# Altium project Sayma_AMC.PrjPcb (part 12 of 18)

## Sheet FPGA_Banks_44_45_46_DDR64.SchDoc: Sayma AMC
size 420 x 297 mm; $$Internal___BlkDate: 0:12:25_2-9-18; $$Internal_NAME_PLACEHOLDER: a3sheet; $$Internal_Resolution: 00001mm; $$NotCommonProperty_@NAME: FPGA_XCKU040FFVA1156; $$NotCommonProperty_@PRINTORDER: 16; $$NotCommonProperty_@SHEET: FPGA Banks 44 45 46 DDR64; $$NotCommonProperty_@SHEETTOTAL: 30; CmpIndex: 988; Drawing Author: G.Kasprowicz; Drawing Number: Sayma AMC; Drawing Project: AMC FMC Carrier Board; Drawing Revision: 2.0; SymIndex: 2141; CheckedBy: P.Kulik,T.Przywozki,W.Ruclo; Author: G.Kasprowicz; CompanyName: WUT ISE; DrawnBy: G.Kasprowicz; Organization: WUT ISE; Address1: PW ISE; Address2: Nowowiejska 15/19 00-665 Warsaw; Address3: gkasprow@gmail.com; DocumentNumber: 23; Revision: 2; SheetNumber: 23; SheetTotal: 32; ModifiedBy: -; CheckedDate: -; Title2: FPGA banks 44, 45 & 46 (DDR); DivGrp: WUT ISE; Designer: G.Kasprowicz; ModifiedDate: -; ProjectName: Sensor Box
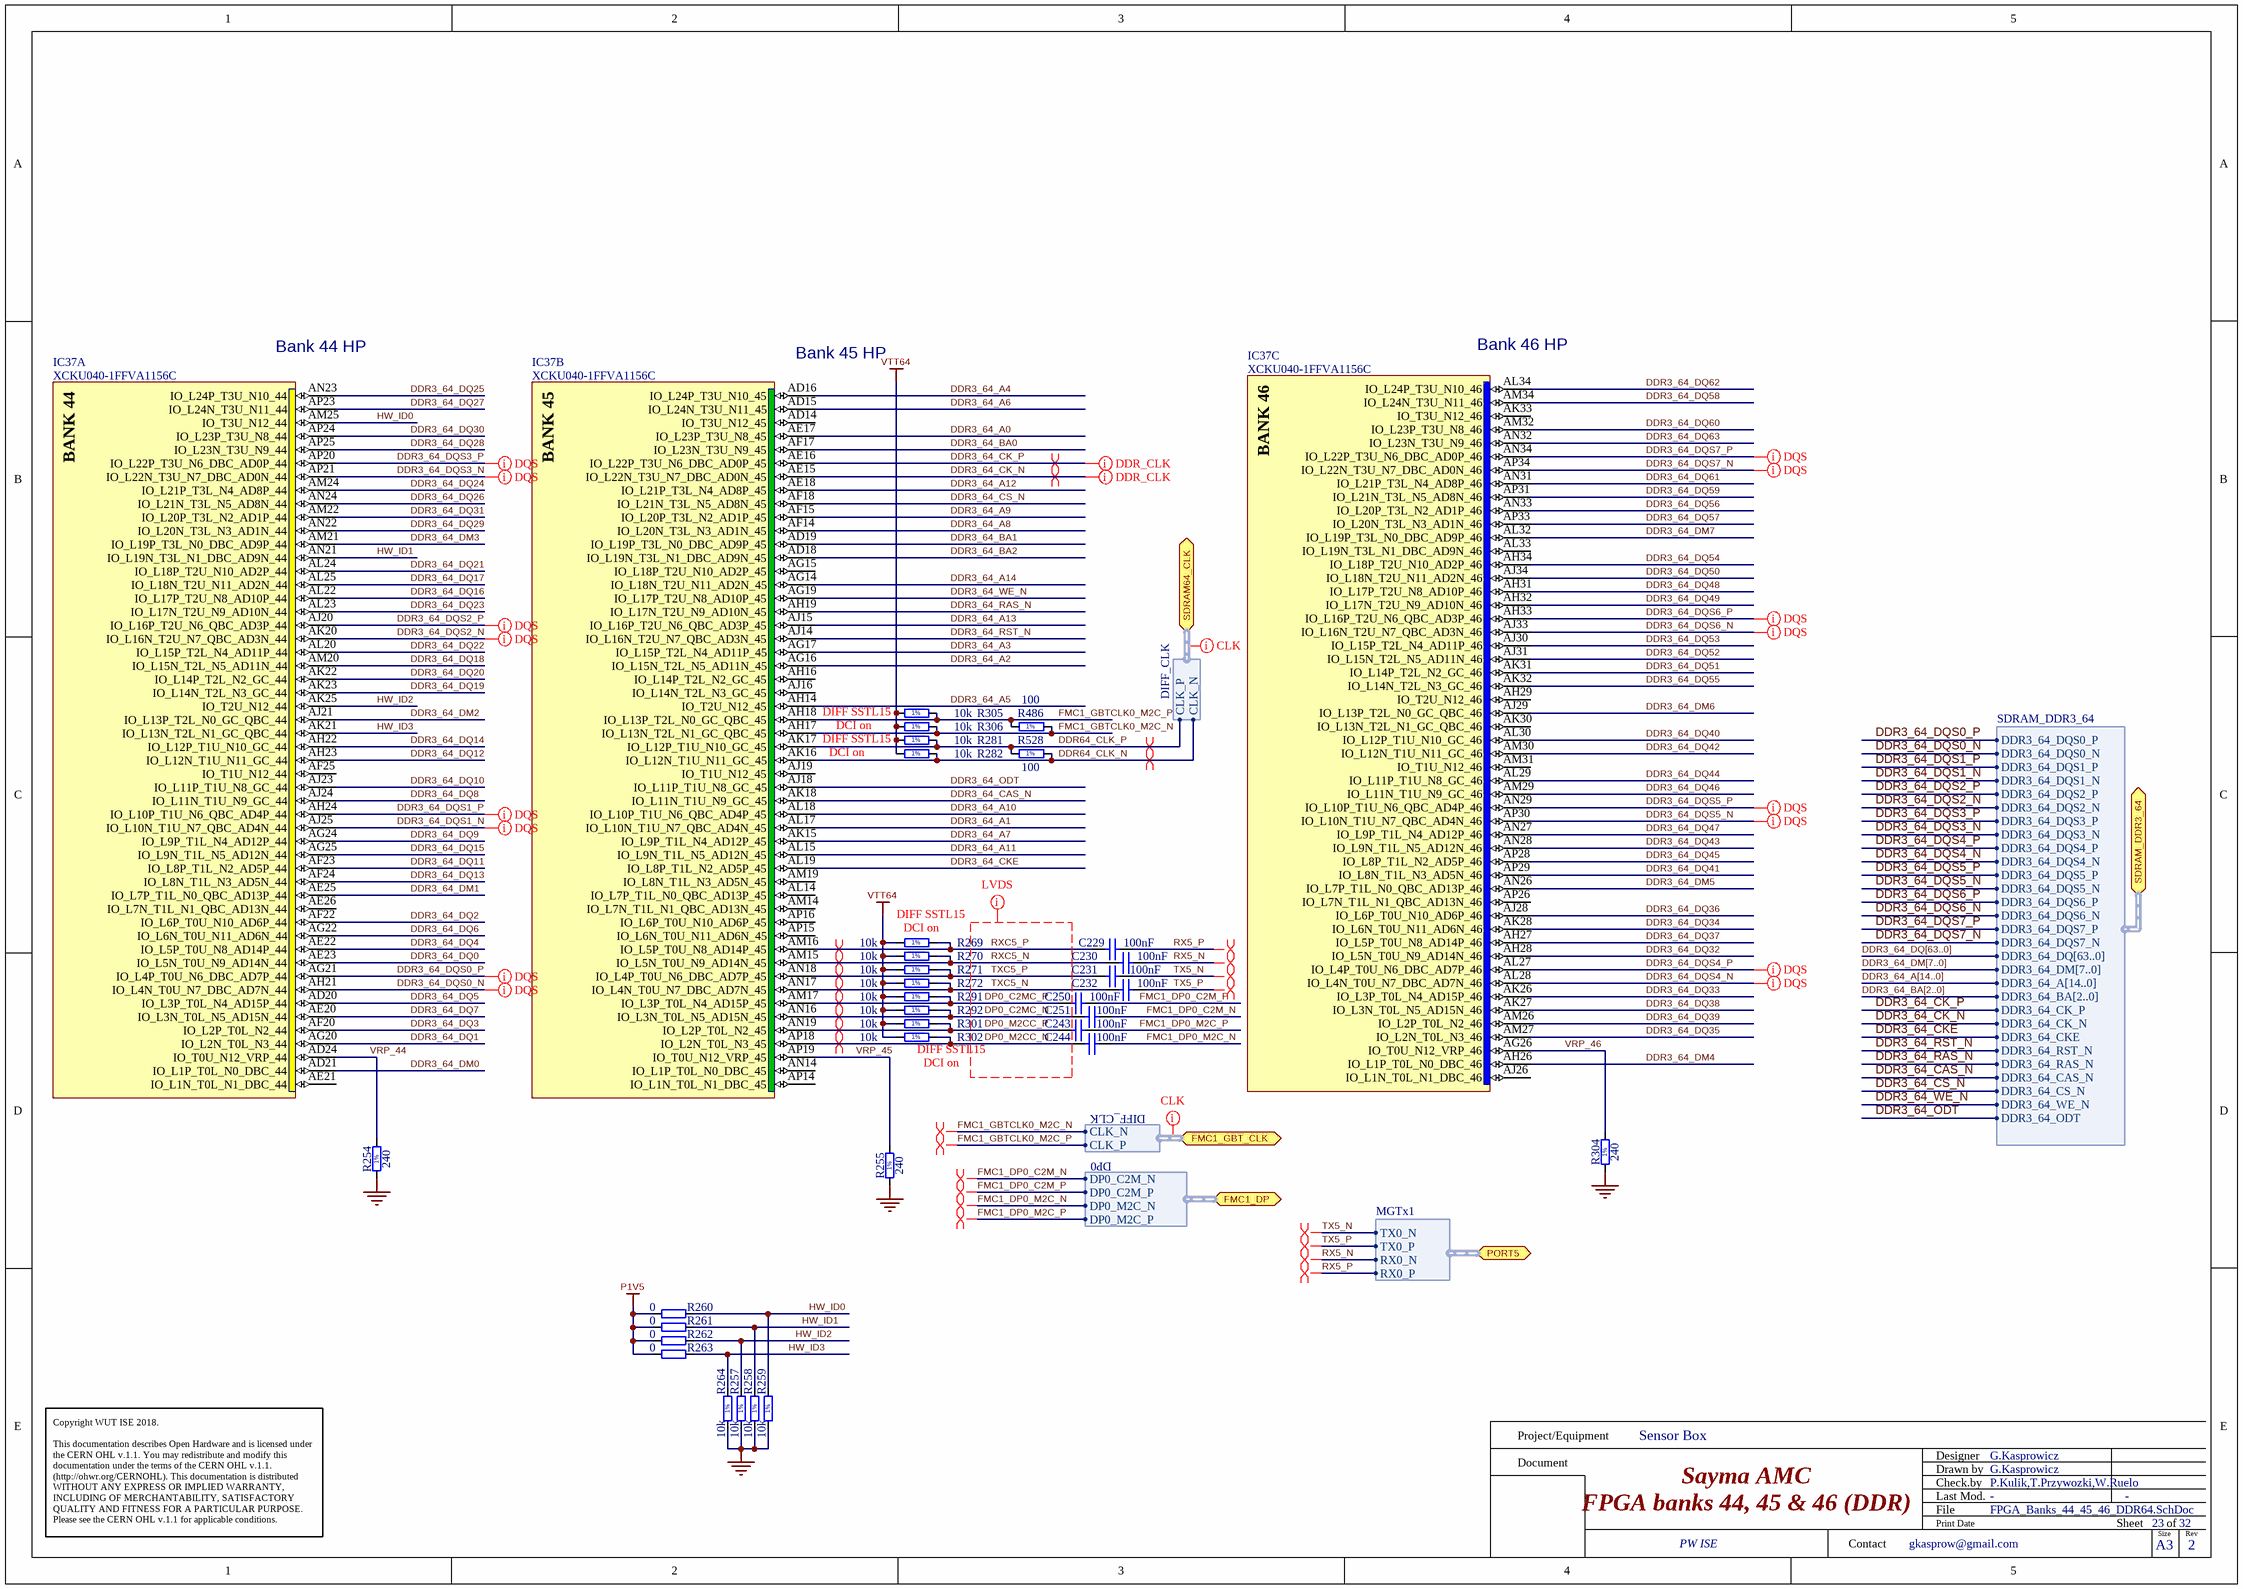
[diagram p21: FPGA_Banks_44_45_46_DDR64.SchDoc]

### Parts
C229  100nF  [CAPC0603X33N]
C230  100nF  [CAPC0603X33N]
C231  100nF  [CAPC0603X33N]
C232  100nF  [CAPC0603X33N]
C243  100nF  [CAPC0603X33N]
C244  100nF  [CAPC0603X33N]
C250  100nF  [CAPC0603X33N]
C251  100nF  [CAPC0603X33N]
IC37  XCKU040-1FFVA1156C  [BGA1156C100P34X34_3500X3500X350]  (parts A,B,C of 22)
R254  240  [RESC1005X40N]
R255  240  [RESC1005X40N]
R257  10k  [RESC1005X40N]
R258  10k  [RESC1005X40N]
R259  10k  [RESC1005X40N]
R260  0  [RESC1005X40N]
R261  0  [RESC1005X40N]
R262  0  [RESC1005X40N]
R263  0  [RESC1005X40N]
R264  10k  [RESC1005X40N]
R269  10k  [RESC1005X40N]
R270  10k  [RESC1005X40N]
R271  10k  [RESC1005X40N]
R272  10k  [RESC1005X40N]
R281  10k  [RESC1005X40N]
R282  10k  [RESC1005X40N]
R291  10k  [RESC1005X40N]
R292  10k  [RESC1005X40N]
R301  10k  [RESC1005X40N]
R302  10k  [RESC1005X40N]
R304  240  [RESC1005X40N]
R305  10k  [RESC1005X40N]
R306  10k  [RESC1005X40N]
R486  100  [RESC0603X28N]
R528  100  [RESC0603X28N]

### Ports
FMC1_DP (bidir, harness DP0), FMC1_GBT_CLK (bidir, harness DIFF_CLK), PORT5 (bidir, harness MGTx1), SDRAM64_CLK (bidir, harness DIFF_CLK), SDRAM_DDR3_64 (bidir, harness SDRAM_DDR3_64)

### Harnesses
SDRAM_DDR3_64: DDR3_64_DQS0_P, DDR3_64_DQS0_N, DDR3_64_DQS1_P, DDR3_64_DQS1_N, DDR3_64_DQS2_P, DDR3_64_DQS2_N, DDR3_64_DQS3_P, DDR3_64_DQS3_N, DDR3_64_DQS4_P, DDR3_64_DQS4_N, DDR3_64_DQS5_P, DDR3_64_DQS5_N, DDR3_64_DQS6_P, DDR3_64_DQS6_N, DDR3_64_DQS7_P, DDR3_64_DQS7_N, DDR3_64_DQ[63..0], DDR3_64_DM[7..0], DDR3_64_A[14..0], DDR3_64_BA[2..0], DDR3_64_CK_P, DDR3_64_CK_N, DDR3_64_CKE, DDR3_64_RST_N, DDR3_64_RAS_N, DDR3_64_CAS_N, DDR3_64_CS_N, DDR3_64_WE_N, DDR3_64_ODT
DIFF_CLK: CLK_P, CLK_N
DP0: DP0_C2M_N, DP0_C2M_P, DP0_M2C_N, DP0_M2C_P
MGTx1: RX0_P, RX0_N, TX0_P, TX0_N
DIFF_CLK: CLK_N, CLK_P

### Nets
GND: R254.1 R255.1 R257.1 R258.1 R259.1 R264.1 R304.1
P1V5: R260.1 R261.1 R262.1 R263.1
VTT64: R269.1 R270.1 R271.1 R272.1 R281.1 R282.1 R291.1 R292.1 R301.1 R302.1 R305.1 R306.1
DDR3_64_A0: IC37.AE17(IO_L23P_T3U_N8_45)
DDR3_64_A1: IC37.AL17(IO_L10N_T1U_N7_QBC_AD4N_45)
DDR3_64_A2: IC37.AG16(IO_L15N_T2L_N5_AD11N_45)
DDR3_64_A3: IC37.AG17(IO_L15P_T2L_N4_AD11P_45)
DDR3_64_A4: IC37.AD16(IO_L24P_T3U_N10_45)
DDR3_64_A5: IC37.AH14(IO_T2U_N12_45)
DDR3_64_A6: IC37.AD15(IO_L24N_T3U_N11_45)
DDR3_64_A7: IC37.AK15(IO_L9P_T1L_N4_AD12P_45)
DDR3_64_A8: IC37.AF14(IO_L20N_T3L_N3_AD1N_45)
DDR3_64_A9: IC37.AF15(IO_L20P_T3L_N2_AD1P_45)
DDR3_64_A10: IC37.AL18(IO_L10P_T1U_N6_QBC_AD4P_45)
DDR3_64_A11: IC37.AL15(IO_L9N_T1L_N5_AD12N_45)
DDR3_64_A12: IC37.AE18(IO_L21P_T3L_N4_AD8P_45)
DDR3_64_A13: IC37.AJ15(IO_L16P_T2U_N6_QBC_AD3P_45)
DDR3_64_A14: IC37.AG14(IO_L18N_T2U_N11_AD2N_45)
DDR3_64_BA0: IC37.AF17(IO_L23N_T3U_N9_45)
DDR3_64_BA1: IC37.AD19(IO_L19P_T3L_N0_DBC_AD9P_45)
DDR3_64_BA2: IC37.AD18(IO_L19N_T3L_N1_DBC_AD9N_45)
DDR3_64_CAS_N: IC37.AK18(IO_L11N_T1U_N9_GC_45) ; port SDRAM_DDR3_64.DDR3_64_CAS_N
DDR3_64_CK_N: IC37.AE15(IO_L22N_T3U_N7_DBC_AD0N_45) ; port SDRAM_DDR3_64.DDR3_64_CK_N
DDR3_64_CK_P: IC37.AE16(IO_L22P_T3U_N6_DBC_AD0P_45) ; port SDRAM_DDR3_64.DDR3_64_CK_P
DDR3_64_CKE: IC37.AL19(IO_L8P_T1L_N2_AD5P_45) ; port SDRAM_DDR3_64.DDR3_64_CKE
DDR3_64_CS_N: IC37.AF18(IO_L21N_T3L_N5_AD8N_45) ; port SDRAM_DDR3_64.DDR3_64_CS_N
DDR3_64_DM0: IC37.AD21(IO_L1P_T0L_N0_DBC_44)
DDR3_64_DM1: IC37.AE25(IO_L7P_T1L_N0_QBC_AD13P_44)
DDR3_64_DM2: IC37.AJ21(IO_L13P_T2L_N0_GC_QBC_44)
DDR3_64_DM3: IC37.AM21(IO_L19P_T3L_N0_DBC_AD9P_44)
DDR3_64_DM4: IC37.AH26(IO_L1P_T0L_N0_DBC_46)
DDR3_64_DM5: IC37.AN26(IO_L7P_T1L_N0_QBC_AD13P_46)
DDR3_64_DM6: IC37.AJ29(IO_L13P_T2L_N0_GC_QBC_46)
DDR3_64_DM7: IC37.AL32(IO_L19P_T3L_N0_DBC_AD9P_46)
DDR3_64_DQ0: IC37.AE23(IO_L5N_T0U_N9_AD14N_44)
DDR3_64_DQ1: IC37.AG20(IO_L2N_T0L_N3_44)
DDR3_64_DQ2: IC37.AF22(IO_L6P_T0U_N10_AD6P_44)
DDR3_64_DQ3: IC37.AF20(IO_L2P_T0L_N2_44)
DDR3_64_DQ4: IC37.AE22(IO_L5P_T0U_N8_AD14P_44)
DDR3_64_DQ5: IC37.AD20(IO_L3P_T0L_N4_AD15P_44)
DDR3_64_DQ6: IC37.AG22(IO_L6N_T0U_N11_AD6N_44)
DDR3_64_DQ7: IC37.AE20(IO_L3N_T0L_N5_AD15N_44)
DDR3_64_DQ8: IC37.AJ24(IO_L11N_T1U_N9_GC_44)
DDR3_64_DQ9: IC37.AG24(IO_L9P_T1L_N4_AD12P_44)
DDR3_64_DQ10: IC37.AJ23(IO_L11P_T1U_N8_GC_44)
DDR3_64_DQ11: IC37.AF23(IO_L8P_T1L_N2_AD5P_44)
DDR3_64_DQ12: IC37.AH23(IO_L12N_T1U_N11_GC_44)
DDR3_64_DQ13: IC37.AF24(IO_L8N_T1L_N3_AD5N_44)
DDR3_64_DQ14: IC37.AH22(IO_L12P_T1U_N10_GC_44)
DDR3_64_DQ15: IC37.AG25(IO_L9N_T1L_N5_AD12N_44)
DDR3_64_DQ16: IC37.AL22(IO_L17P_T2U_N8_AD10P_44)
DDR3_64_DQ17: IC37.AL25(IO_L18N_T2U_N11_AD2N_44)
DDR3_64_DQ18: IC37.AM20(IO_L15N_T2L_N5_AD11N_44)
DDR3_64_DQ19: IC37.AK23(IO_L14N_T2L_N3_GC_44)
DDR3_64_DQ20: IC37.AK22(IO_L14P_T2L_N2_GC_44)
DDR3_64_DQ21: IC37.AL24(IO_L18P_T2U_N10_AD2P_44)
DDR3_64_DQ22: IC37.AL20(IO_L15P_T2L_N4_AD11P_44)
DDR3_64_DQ23: IC37.AL23(IO_L17N_T2U_N9_AD10N_44)
DDR3_64_DQ24: IC37.AM24(IO_L21P_T3L_N4_AD8P_44)
DDR3_64_DQ25: IC37.AN23(IO_L24P_T3U_N10_44)
DDR3_64_DQ26: IC37.AN24(IO_L21N_T3L_N5_AD8N_44)
DDR3_64_DQ27: IC37.AP23(IO_L24N_T3U_N11_44)
DDR3_64_DQ28: IC37.AP25(IO_L23N_T3U_N9_44)
DDR3_64_DQ29: IC37.AN22(IO_L20N_T3L_N3_AD1N_44)
DDR3_64_DQ30: IC37.AP24(IO_L23P_T3U_N8_44)
DDR3_64_DQ31: IC37.AM22(IO_L20P_T3L_N2_AD1P_44)
DDR3_64_DQ32: IC37.AH28(IO_L5N_T0U_N9_AD14N_46)
DDR3_64_DQ33: IC37.AK26(IO_L3P_T0L_N4_AD15P_46)
DDR3_64_DQ34: IC37.AK28(IO_L6N_T0U_N11_AD6N_46)
DDR3_64_DQ35: IC37.AM27(IO_L2N_T0L_N3_46)
DDR3_64_DQ36: IC37.AJ28(IO_L6P_T0U_N10_AD6P_46)
DDR3_64_DQ37: IC37.AH27(IO_L5P_T0U_N8_AD14P_46)
DDR3_64_DQ38: IC37.AK27(IO_L3N_T0L_N5_AD15N_46)
DDR3_64_DQ39: IC37.AM26(IO_L2P_T0L_N2_46)
DDR3_64_DQ40: IC37.AL30(IO_L12P_T1U_N10_GC_46)
DDR3_64_DQ41: IC37.AP29(IO_L8N_T1L_N3_AD5N_46)
DDR3_64_DQ42: IC37.AM30(IO_L12N_T1U_N11_GC_46)
DDR3_64_DQ43: IC37.AN28(IO_L9N_T1L_N5_AD12N_46)
DDR3_64_DQ44: IC37.AL29(IO_L11P_T1U_N8_GC_46)
DDR3_64_DQ45: IC37.AP28(IO_L8P_T1L_N2_AD5P_46)
DDR3_64_DQ46: IC37.AM29(IO_L11N_T1U_N9_GC_46)
DDR3_64_DQ47: IC37.AN27(IO_L9P_T1L_N4_AD12P_46)
DDR3_64_DQ48: IC37.AH31(IO_L17P_T2U_N8_AD10P_46)
DDR3_64_DQ49: IC37.AH32(IO_L17N_T2U_N9_AD10N_46)
DDR3_64_DQ50: IC37.AJ34(IO_L18N_T2U_N11_AD2N_46)
DDR3_64_DQ51: IC37.AK31(IO_L14P_T2L_N2_GC_46)
DDR3_64_DQ52: IC37.AJ31(IO_L15N_T2L_N5_AD11N_46)
DDR3_64_DQ53: IC37.AJ30(IO_L15P_T2L_N4_AD11P_46)
DDR3_64_DQ54: IC37.AH34(IO_L18P_T2U_N10_AD2P_46)
DDR3_64_DQ55: IC37.AK32(IO_L14N_T2L_N3_GC_46)
DDR3_64_DQ56: IC37.AN33(IO_L20P_T3L_N2_AD1P_46)
DDR3_64_DQ57: IC37.AP33(IO_L20N_T3L_N3_AD1N_46)
DDR3_64_DQ58: IC37.AM34(IO_L24N_T3U_N11_46)
DDR3_64_DQ59: IC37.AP31(IO_L21N_T3L_N5_AD8N_46)
DDR3_64_DQ60: IC37.AM32(IO_L23P_T3U_N8_46)
DDR3_64_DQ61: IC37.AN31(IO_L21P_T3L_N4_AD8P_46)
DDR3_64_DQ62: IC37.AL34(IO_L24P_T3U_N10_46)
DDR3_64_DQ63: IC37.AN32(IO_L23N_T3U_N9_46)
DDR3_64_DQS0_N: IC37.AH21(IO_L4N_T0U_N7_DBC_AD7N_44) ; port SDRAM_DDR3_64.DDR3_64_DQS0_N
DDR3_64_DQS0_P: IC37.AG21(IO_L4P_T0U_N6_DBC_AD7P_44) ; port SDRAM_DDR3_64.DDR3_64_DQS0_P
DDR3_64_DQS1_N: IC37.AJ25(IO_L10N_T1U_N7_QBC_AD4N_44) ; port SDRAM_DDR3_64.DDR3_64_DQS1_N
DDR3_64_DQS1_P: IC37.AH24(IO_L10P_T1U_N6_QBC_AD4P_44) ; port SDRAM_DDR3_64.DDR3_64_DQS1_P
DDR3_64_DQS2_N: IC37.AK20(IO_L16N_T2U_N7_QBC_AD3N_44) ; port SDRAM_DDR3_64.DDR3_64_DQS2_N
DDR3_64_DQS2_P: IC37.AJ20(IO_L16P_T2U_N6_QBC_AD3P_44) ; port SDRAM_DDR3_64.DDR3_64_DQS2_P
DDR3_64_DQS3_N: IC37.AP21(IO_L22N_T3U_N7_DBC_AD0N_44) ; port SDRAM_DDR3_64.DDR3_64_DQS3_N
DDR3_64_DQS3_P: IC37.AP20(IO_L22P_T3U_N6_DBC_AD0P_44) ; port SDRAM_DDR3_64.DDR3_64_DQS3_P
DDR3_64_DQS4_N: IC37.AL28(IO_L4N_T0U_N7_DBC_AD7N_46) ; port SDRAM_DDR3_64.DDR3_64_DQS4_N
DDR3_64_DQS4_P: IC37.AL27(IO_L4P_T0U_N6_DBC_AD7P_46) ; port SDRAM_DDR3_64.DDR3_64_DQS4_P
DDR3_64_DQS5_N: IC37.AP30(IO_L10N_T1U_N7_QBC_AD4N_46) ; port SDRAM_DDR3_64.DDR3_64_DQS5_N
DDR3_64_DQS5_P: IC37.AN29(IO_L10P_T1U_N6_QBC_AD4P_46) ; port SDRAM_DDR3_64.DDR3_64_DQS5_P
DDR3_64_DQS6_N: IC37.AJ33(IO_L16N_T2U_N7_QBC_AD3N_46) ; port SDRAM_DDR3_64.DDR3_64_DQS6_N
DDR3_64_DQS6_P: IC37.AH33(IO_L16P_T2U_N6_QBC_AD3P_46) ; port SDRAM_DDR3_64.DDR3_64_DQS6_P
DDR3_64_DQS7_N: IC37.AP34(IO_L22N_T3U_N7_DBC_AD0N_46) ; port SDRAM_DDR3_64.DDR3_64_DQS7_N
DDR3_64_DQS7_P: IC37.AN34(IO_L22P_T3U_N6_DBC_AD0P_46) ; port SDRAM_DDR3_64.DDR3_64_DQS7_P
DDR3_64_ODT: IC37.AJ18(IO_L11P_T1U_N8_GC_45) ; port SDRAM_DDR3_64.DDR3_64_ODT
DDR3_64_RAS_N: IC37.AH19(IO_L17N_T2U_N9_AD10N_45) ; port SDRAM_DDR3_64.DDR3_64_RAS_N
DDR3_64_RST_N: IC37.AJ14(IO_L16N_T2U_N7_QBC_AD3N_45) ; port SDRAM_DDR3_64.DDR3_64_RST_N
DDR3_64_WE_N: IC37.AG19(IO_L17P_T2U_N8_AD10P_45) ; port SDRAM_DDR3_64.DDR3_64_WE_N
DDR64_CLK_N: IC37.AK16(IO_L12N_T1U_N11_GC_45) R282.2 R528.2 ; port SDRAM64_CLK.CLK_N
DDR64_CLK_P: IC37.AK17(IO_L12P_T1U_N10_GC_45) R281.2 R528.1 ; port SDRAM64_CLK.CLK_P
DP0_C2MC_N: C251.1 IC37.AN16(IO_L3N_T0L_N5_AD15N_45) R292.2
DP0_C2MC_P: C250.1 IC37.AM17(IO_L3P_T0L_N4_AD15P_45) R291.2
DP0_M2CC_N: C244.1 IC37.AP18(IO_L2N_T0L_N3_45) R302.2
DP0_M2CC_P: C243.1 IC37.AN19(IO_L2P_T0L_N2_45) R301.2
FMC1_DP0_C2M_N: C251.2 ; port FMC1_DP.DP0_C2M_N  [project net DP0_C2M_N]
FMC1_DP0_C2M_P: C250.2 ; port FMC1_DP.DP0_C2M_P  [project net DP0_C2M_P]
FMC1_DP0_M2C_N: C244.2 ; port FMC1_DP.DP0_M2C_N  [project net DP0_M2C_N]
FMC1_DP0_M2C_P: C243.2 ; port FMC1_DP.DP0_M2C_P  [project net DP0_M2C_P]
FMC1_GBTCLK0_M2C_N: IC37.AH17(IO_L13N_T2L_N1_GC_QBC_45) R306.2 R486.2 ; port FMC1_GBT_CLK.CLK_N
FMC1_GBTCLK0_M2C_P: IC37.AH18(IO_L13P_T2L_N0_GC_QBC_45) R305.2 R486.1 ; port FMC1_GBT_CLK.CLK_P
HW_ID0: IC37.AM25(IO_T3U_N12_44) R259.2 R260.2
HW_ID1: IC37.AN21(IO_L19N_T3L_N1_DBC_AD9N_44) R258.2 R261.2
HW_ID2: IC37.AK25(IO_T2U_N12_44) R257.2 R262.2
HW_ID3: IC37.AK21(IO_L13N_T2L_N1_GC_QBC_44) R263.2 R264.2
Rx5_N: C230.2 ; port PORT5.RX0_N
Rx5_P: C229.2 ; port PORT5.RX0_P
RXC5_N: C230.1 IC37.AM15(IO_L5N_T0U_N9_AD14N_45) R270.2
RXC5_P: C229.1 IC37.AM16(IO_L5P_T0U_N8_AD14P_45) R269.2
Tx5_N: C231.2 ; port PORT5.TX0_N
Tx5_P: C232.2 ; port PORT5.TX0_P
TXC5_N: C232.1 IC37.AN17(IO_L4N_T0U_N7_DBC_AD7N_45) R272.2
TXC5_P: C231.1 IC37.AN18(IO_L4P_T0U_N6_DBC_AD7P_45) R271.2
VRP_44: IC37.AD24(IO_T0U_N12_VRP_44) R254.2
VRP_45: IC37.AP19(IO_T0U_N12_VRP_45) R255.2
VRP_46: IC37.AG26(IO_T0U_N12_VRP_46) R304.2

Not connected (* = marked no-connect by the designer): IC37 AD14(IO_T3U_N12_45) AE21(IO_L1N_T0L_N1_DBC_44) AE26(IO_L7N_T1L_N1_QBC_AD13N_44) AF25(IO_T1U_N12_44) AG15(IO_L18P_T2U_N10_AD2P_45) AH16(IO_L14P_T2L_N2_GC_45) AH29(IO_T2U_N12_46) AJ16(IO_L14N_T2L_N3_GC_45) AJ19(IO_T1U_N12_45) AJ26(IO_L1N_T0L_N1_DBC_46) AK30(IO_L13N_T2L_N1_GC_QBC_46) AK33(IO_T3U_N12_46) AL14(IO_L7P_T1L_N0_QBC_AD13P_45) AL33(IO_L19N_T3L_N1_DBC_AD9N_46) AM14(IO_L7N_T1L_N1_QBC_AD13N_45) AM19(IO_L8N_T1L_N3_AD5N_45) AM31(IO_T1U_N12_46) AN14(IO_L1P_T0L_N0_DBC_45) AP14(IO_L1N_T0L_N1_DBC_45) AP15(IO_L6N_T0U_N11_AD6N_45) AP16(IO_L6P_T0U_N10_AD6P_45) AP26(IO_L7N_T1L_N1_QBC_AD13N_46)

### Buses and harness runs
bus DDR3_64_A[14..0]
bus DDR3_64_BA[2..0]
bus DDR3_64_DM[7..0]
bus DDR3_64_DQ[63..0]

### Layout directives
differential pair: DDR3_64_CK_N, DDR3_64_CK_P, DDR64_CLK_N, DDR64_CLK_P, DP0_C2M_N, DP0_C2M_P, DP0_C2MC_N, DP0_C2MC_P, DP0_M2C_N, DP0_M2C_P, DP0_M2CC_N, DP0_M2CC_P, FMC1_GBTCLK0_M2C_N, FMC1_GBTCLK0_M2C_P, Rx5_N, Rx5_P, RXC5_N, RXC5_P, Tx5_N, Tx5_P, TXC5_N, TXC5_P
net class LVDS: DP0_C2MC_N, DP0_C2MC_P, DP0_M2CC_N, DP0_M2CC_P, RXC5_N, RXC5_P, TXC5_N, TXC5_P
net class CLK: (no net found under the mark)
net class DQS: DDR3_64_DQS0_N, DDR3_64_DQS0_P, DDR3_64_DQS1_N, DDR3_64_DQS1_P, DDR3_64_DQS2_N, DDR3_64_DQS2_P, DDR3_64_DQS3_N, DDR3_64_DQS3_P, DDR3_64_DQS4_N, DDR3_64_DQS4_P, DDR3_64_DQS5_N, DDR3_64_DQS5_P, DDR3_64_DQS6_N, DDR3_64_DQS6_P, DDR3_64_DQS7_N, DDR3_64_DQS7_P
net class DDR_CLK: DDR3_64_CK_N, DDR3_64_CK_P

### Notes on the sheet
- (near IC37) Bank 44 HP
- (near IC37) Bank 45 HP
- (near IC37) Bank 46 HP
- DIFF SSTL15
- DCI on
- (near R269) DCI on
- (near R302) DIFF SSTL15
- Project/Equipment
- Document
- Designer
- Drawn by
- Check.by
- Copyright WUT ISE 2018.
  This documentation describes Open Hardware and is licensed under the CERN OHL v.1.1. You may redistribute and modify this documentation under the terms of the CERN OHL v.1.1. (http://ohwr.org/CERNOHL). This documentation is distributed WITHOUT ANY EXPRESS OR IMPLIED WARRANTY, INCLUDING OF MERCHANTABILITY, SATISFACTORY QUALITY AND FITNESS FOR A PARTICULAR PURPOSE. Please see the CERN OHL v.1.1 for applicable conditions.
- Contact
- File
- Last Mod.
- Print Date
- Sheet
- Size
- A3
- of
- Rev
- (in symbol R0201_100R_1%_0.05W_200PPM) 1%
- (in symbol R0402_10K_1%_0.0625W_100PPM) 1%
- (in symbol R0402_240R_1%_0.0625W_100PPM) 1%
- (in symbol XCKU040-1FFVA1156C, part A) BANK 44
- (in symbol XCKU040-1FFVA1156C, part B) BANK 45
- (in symbol XCKU040-1FFVA1156C, part C) BANK 46

### Library data of the parts
C229-C232 C243 C244 C250 C251 = CC0201_100NF_6.3V_10%_X5R: as C2 on sheet CPU_LPC1776; Manufacturer Part Number: CC0201_100NF_6.3V_10%_X5R; Part Number: CC0201_100NF_6.3V_10%_X5R; Value: 100nF; Component Kind: Standard; Component Type: Standard; Pin Count: 2; Status: Not Recommended; Case: 0201; Mounted: Yes; Socket: No; SMD: Yes; Sense: No; Manufacturer1 Example: AVX; Manufacturer1 ComponentHeight: 0.33mm; HelpURL: \\cern.ch\dfs\Applications\Altium\Datasheets\CC0201_X5R_AVX.pdf; Author: CERN DEM JLC; CreateDate: 03.12.2007; LatestRevisionDate: 03.12.2007
IC37 = XCKU040-1FFVA1156C: Kintex UltraScale FPGA, 520 I/O, 530K Cells, 1156-Ball BGA, Speed Grade 1, Commercial Grade; Manufacturer: XILINX; Part Description: Kintex UltraScale, 40 DLL I/O, 416 HP I/O, 104 HR I/O, 1156-Pin BGA, Speed Grade 1, Commercial Grade; PressFit: No; Bonding: No; Manufacturer Part Number: XCKU040-1FFVA1156C; PackageDescription: BGA, 1.00mm Pitch, Square; 1156 Pin, 34 Columns X 34 Rows, Body 35.00mm X 35.00mm X 3.50mm H, IPC Medium Density; Part Number: XCKU040-1FFVA1156C; Component Kind: Standard; Component Type: Standard; Device: XCKU040-1FFVA1156C; Pin Count: 1156; Case: BGA1156; Mounted: Yes; Socket: No; SMD: Yes; Sense: No; ComponentHeight: 3.5mm; HelpURL: \\cern.ch\dfs\Applications\Altium\Datasheets\XCKU040-1FFVA1156C.pdf; ComponentLink1URL: \\cern.ch\dfs\Applications\Altium\Datasheets\XCKU040-1FFVA1156C_Package-Pinout.pdf; ComponentLink1Description: Package/Pinout; Author: CERN DEM CA; CreateDate: 16.08.2016; LatestRevisionDate: 16.08.2016
R254 R255 R304 = R0402_240R_1%_0.0625W_100PPM: Resistor - 1%; Manufacturer: GENERIC; Part Description: General Purpose Thick Film Chip Resistor; Manufacturer1 Part Number: 232270672401L; TC: ±100ppm/°C; PressFit: No; Manufacturer Part Number: R0402_240R_1%_0.0625W_100PPM; Part Number: R0402_240R_1%_0.0625W_100PPM; Tolerance: ±1%; Value: 240; Component Kind: Standard; Component Type: Standard; Pin Count: 2; Status: Not Recommended; Power: 0.0625W; Case: 0402; Mounted: Yes; Sense: No; Socket: No; SMD: Yes; Manufacturer1 Example: YAGEO PHYCOMP; Manufacturer1 ComponentHeight: 0.4mm; HelpURL: \\cern.ch\dfs\Applications\Altium\Datasheets\R0402_Phycomp_RC0402.pdf; Author: CERN DEM JLC; CreateDate: 03.12.2007; LatestRevisionDate: 17.10.2012
R257-R259 R264 R269-R272 R281 R282 R291 R292 R301 R302 R305 R306 = R0402_10K_1%_0.0625W_100PPM: as R405-R407 on sheet CPU_LPC1776; Manufacturer Part Number: R0402_10K_1%_0.0625W_100PPM; Part Number: R0402_10K_1%_0.0625W_100PPM; Tolerance: ±1%; Value: 10k; Component Kind: Standard; Component Type: Standard; Pin Count: 2; Status: Not Recommended; Power: 0.0625W; Case: 0402; Mounted: Yes; Sense: No; Socket: No; SMD: Yes; Manufacturer1 Example: YAGEO PHYCOMP; Manufacturer1 ComponentHeight: 0.4mm; HelpURL: \\cern.ch\dfs\Applications\Altium\Datasheets\R0402_Phycomp_RC0402.pdf; Author: CERN DEM JLC; CreateDate: 03.12.2007; LatestRevisionDate: 17.10.2012
R260-R263 = R0402_0R_JUMPER: as R418-R421 on sheet CPU_LPC1776; Manufacturer Part Number: R0402_0R_JUMPER; Part Number: R0402_0R_JUMPER; Value: 0; Component Kind: Standard; Component Type: Standard; Pin Count: 2; Status: Not Recommended; Case: 0402; Mounted: Yes; Sense: No; Socket: No; SMD: Yes; Manufacturer1 Example: YAGEO PHYCOMP; Manufacturer1 ComponentHeight: 0.4mm; HelpURL: \\cern.ch\dfs\Applications\Altium\Datasheets\R0402_Phycomp_RC0402.pdf; Author: CERN DEM JLC; CreateDate: 03.12.2007; LatestRevisionDate: 17.10.2012
R486 R528 = R0201_100R_1%_0.05W_200PPM: Resistor - 1%; Manufacturer: GENERIC; Part Description: Thick Film Chip Resistor; Manufacturer1 Part Number: CRCW0201100RFNED; Power: 0.05W; TC: ±200ppm/°C; PressFit: No; Manufacturer Part Number: R0201_100R_1%_0.05W_200PPM; Part Number: R0201_100R_1%_0.05W_200PPM; Tolerance: ±1%; Value: 100; Component Kind: Standard; Component Type: Standard; Pin Count: 2; Status: Not Recommended; Case: 0201; Mounted: Yes; Sense: No; Socket: No; SMD: Yes; Manufacturer1 Example: VISHAY; Manufacturer1 ComponentHeight: 0.27mm; HelpURL: \\cern.ch\dfs\Applications\Altium\Datasheets\R0201_VISHAY_CRCW0201 e3.pdf; Author: CERN DEM JLC; CreateDate: 13.11.2014; LatestRevisionDate: 13.11.2014